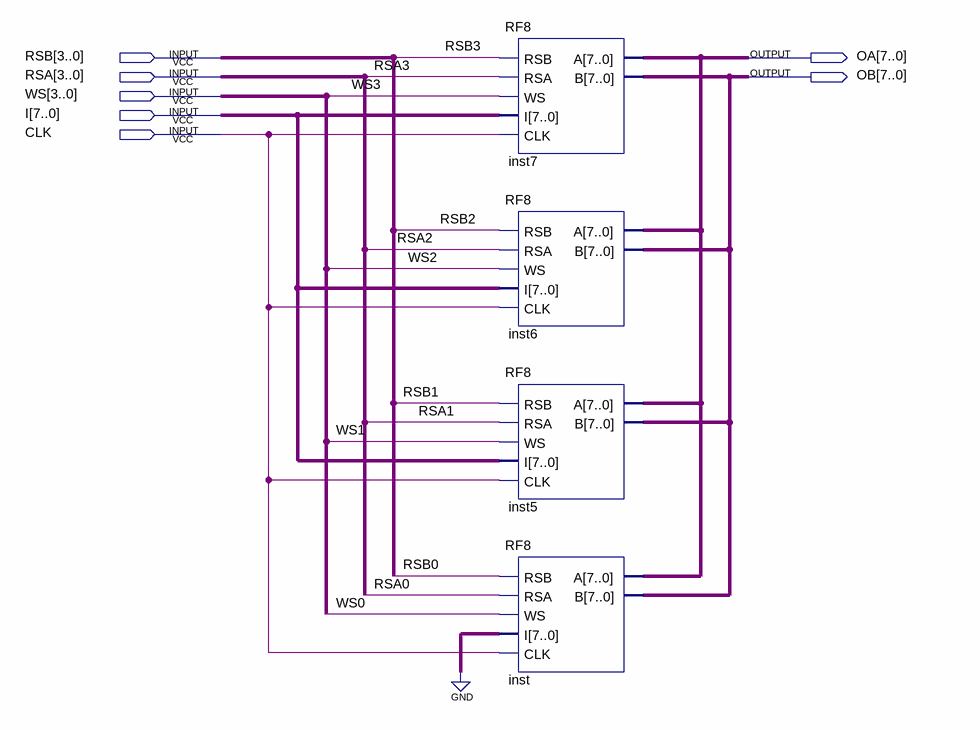
[diagram p0: schematic sheet]
// Quartus schematic RF.bdf as structural Verilog: 4 symbols, 7 pins
module RF (
  input  [3:0] RSB,
  input  [3:0] RSA,
  input  [3:0] WS,
  input  [7:0] I,
  input  CLK,
  output [7:0] OA,
  output [7:0] OB
);

  RF8 inst7 (.RSB(RSB[3]), .RSA(RSA[3]), .WS(WS[3]), .I(I), .CLK(CLK), .A(OA), .B(OB));
  RF8 inst6 (.RSB(RSB[2]), .RSA(RSA[2]), .WS(WS[2]), .I(I), .CLK(CLK), .A(OA), .B(OB));
  RF8 inst5 (.RSB(RSB[1]), .RSA(RSA[1]), .WS(WS[1]), .I(I), .CLK(CLK), .A(OA), .B(OB));
  RF8 inst (.RSB(RSB[0]), .RSA(RSA[0]), .WS(WS[0]), .I({8{1'b0}}), .CLK(CLK), .A(OA), .B(OB));
endmodule
